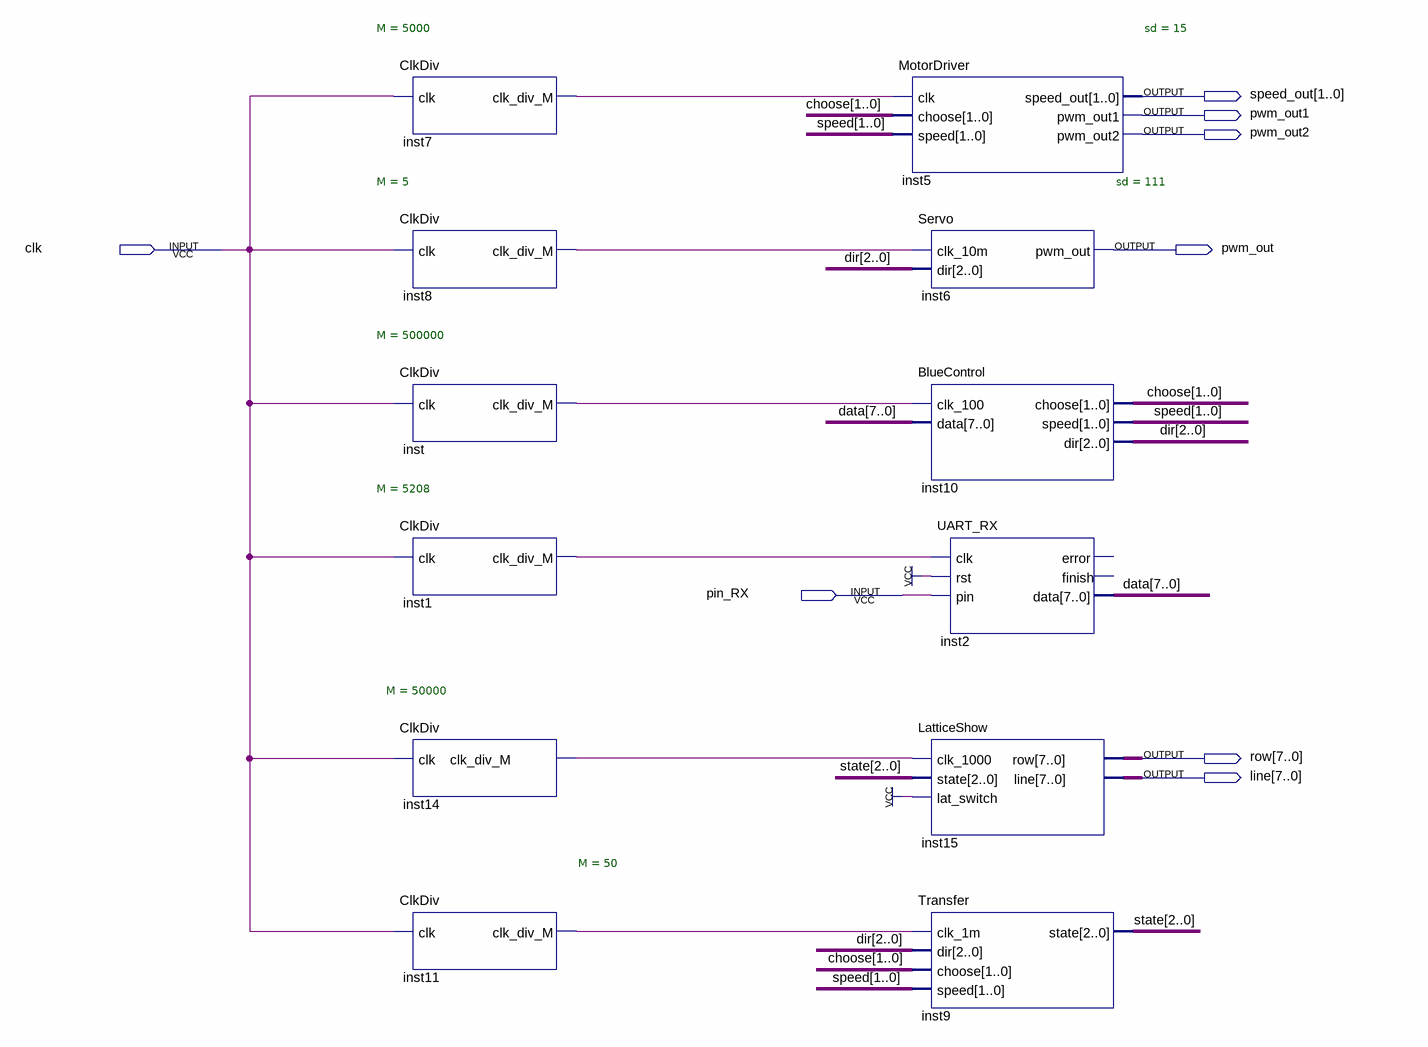
[diagram p0: schematic sheet]
// Quartus schematic BlueTest.bdf as structural Verilog: 12 symbols, 8 pins
module BlueTest (
  input  clk,
  input  pin_RX,
  output [1:0] speed_out,
  output pwm_out1,
  output pwm_out2,
  output pwm_out,
  output [7:0] row,
  output [7:0] line
);

  wire inst1_clk_div_m, inst7_clk_div_m, inst8_clk_div_m, inst11_clk_div_m, inst14_clk_div_m, inst_clk_div_m;
  wire [1:0] choose, speed;
  wire [2:0] dir, state;
  wire [7:0] data;

  ClkDiv #(.M(5000)) inst7 (.clk(clk), .clk_div_M(inst7_clk_div_m));
  ClkDiv #(.M(5)) inst8 (.clk(clk), .clk_div_M(inst8_clk_div_m));
  ClkDiv #(.M(500000)) inst (.clk(clk), .clk_div_M(inst_clk_div_m));
  ClkDiv #(.M(5208)) inst1 (.clk(clk), .clk_div_M(inst1_clk_div_m));
  ClkDiv #(.M(50000)) inst14 (.clk(clk), .clk_div_M(inst14_clk_div_m));
  ClkDiv #(.M(50)) inst11 (.clk(clk), .clk_div_M(inst11_clk_div_m));
  MotorDriver #(.sd(15)) inst5 (
    .clk(inst7_clk_div_m), .choose(choose), .speed(speed), .speed_out(speed_out), .pwm_out1(pwm_out1),
    .pwm_out2(pwm_out2));
  Servo #(.sd(111)) inst6 (.clk_10m(inst8_clk_div_m), .dir(dir), .pwm_out(pwm_out));
  BlueControl inst10 (.clk_100(inst_clk_div_m), .data(data), .choose(choose), .speed(speed), .dir(dir));
  LatticeShow inst15 (.clk_1000(inst14_clk_div_m), .state(state), .lat_switch(1'b1), .row(row), .line(line));
  Transfer inst9 (.clk_1m(inst11_clk_div_m), .dir(dir), .choose(choose), .speed(speed), .state(state));
  UART_RX inst2 (.clk(inst1_clk_div_m), .rst(1'b1), .pin(pin_RX), .data(data));  // open: error, finish
endmodule
